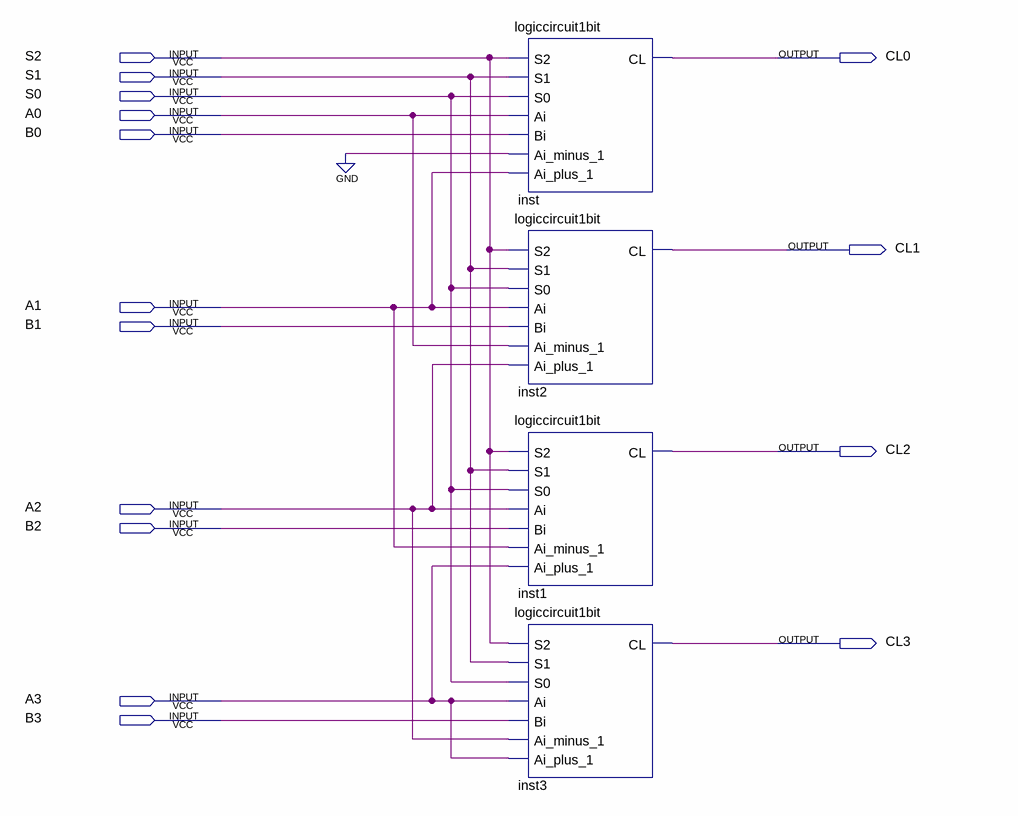
[diagram p0: schematic sheet]
// Quartus schematic logiccircuit4bits.bdf as structural Verilog: 4 symbols, 15 pins
module logiccircuit4bits (
  input  S2,
  input  S1,
  input  S0,
  input  A0,
  input  B0,
  input  A1,
  input  B1,
  input  A2,
  input  B2,
  input  A3,
  input  B3,
  output CL0,
  output CL1,
  output CL2,
  output CL3
);

  logiccircuit1bit inst (.S2(S2), .S1(S1), .S0(S0), .Ai(A0), .Bi(B0), .Ai_minus_1(1'b0), .Ai_plus_1(A1), .CL(CL0));
  logiccircuit1bit inst2 (.S2(S2), .S1(S1), .S0(S0), .Ai(A1), .Bi(B1), .Ai_minus_1(A0), .Ai_plus_1(A2), .CL(CL1));
  logiccircuit1bit inst1 (.S2(S2), .S1(S1), .S0(S0), .Ai(A2), .Bi(B2), .Ai_minus_1(A1), .Ai_plus_1(A3), .CL(CL2));
  logiccircuit1bit inst3 (.S2(S2), .S1(S1), .S0(S0), .Ai(A3), .Bi(B3), .Ai_minus_1(A2), .Ai_plus_1(A3), .CL(CL3));
endmodule
